# EAGLE design OptimuxPrimeSafe (EAGLE 8.3.2)
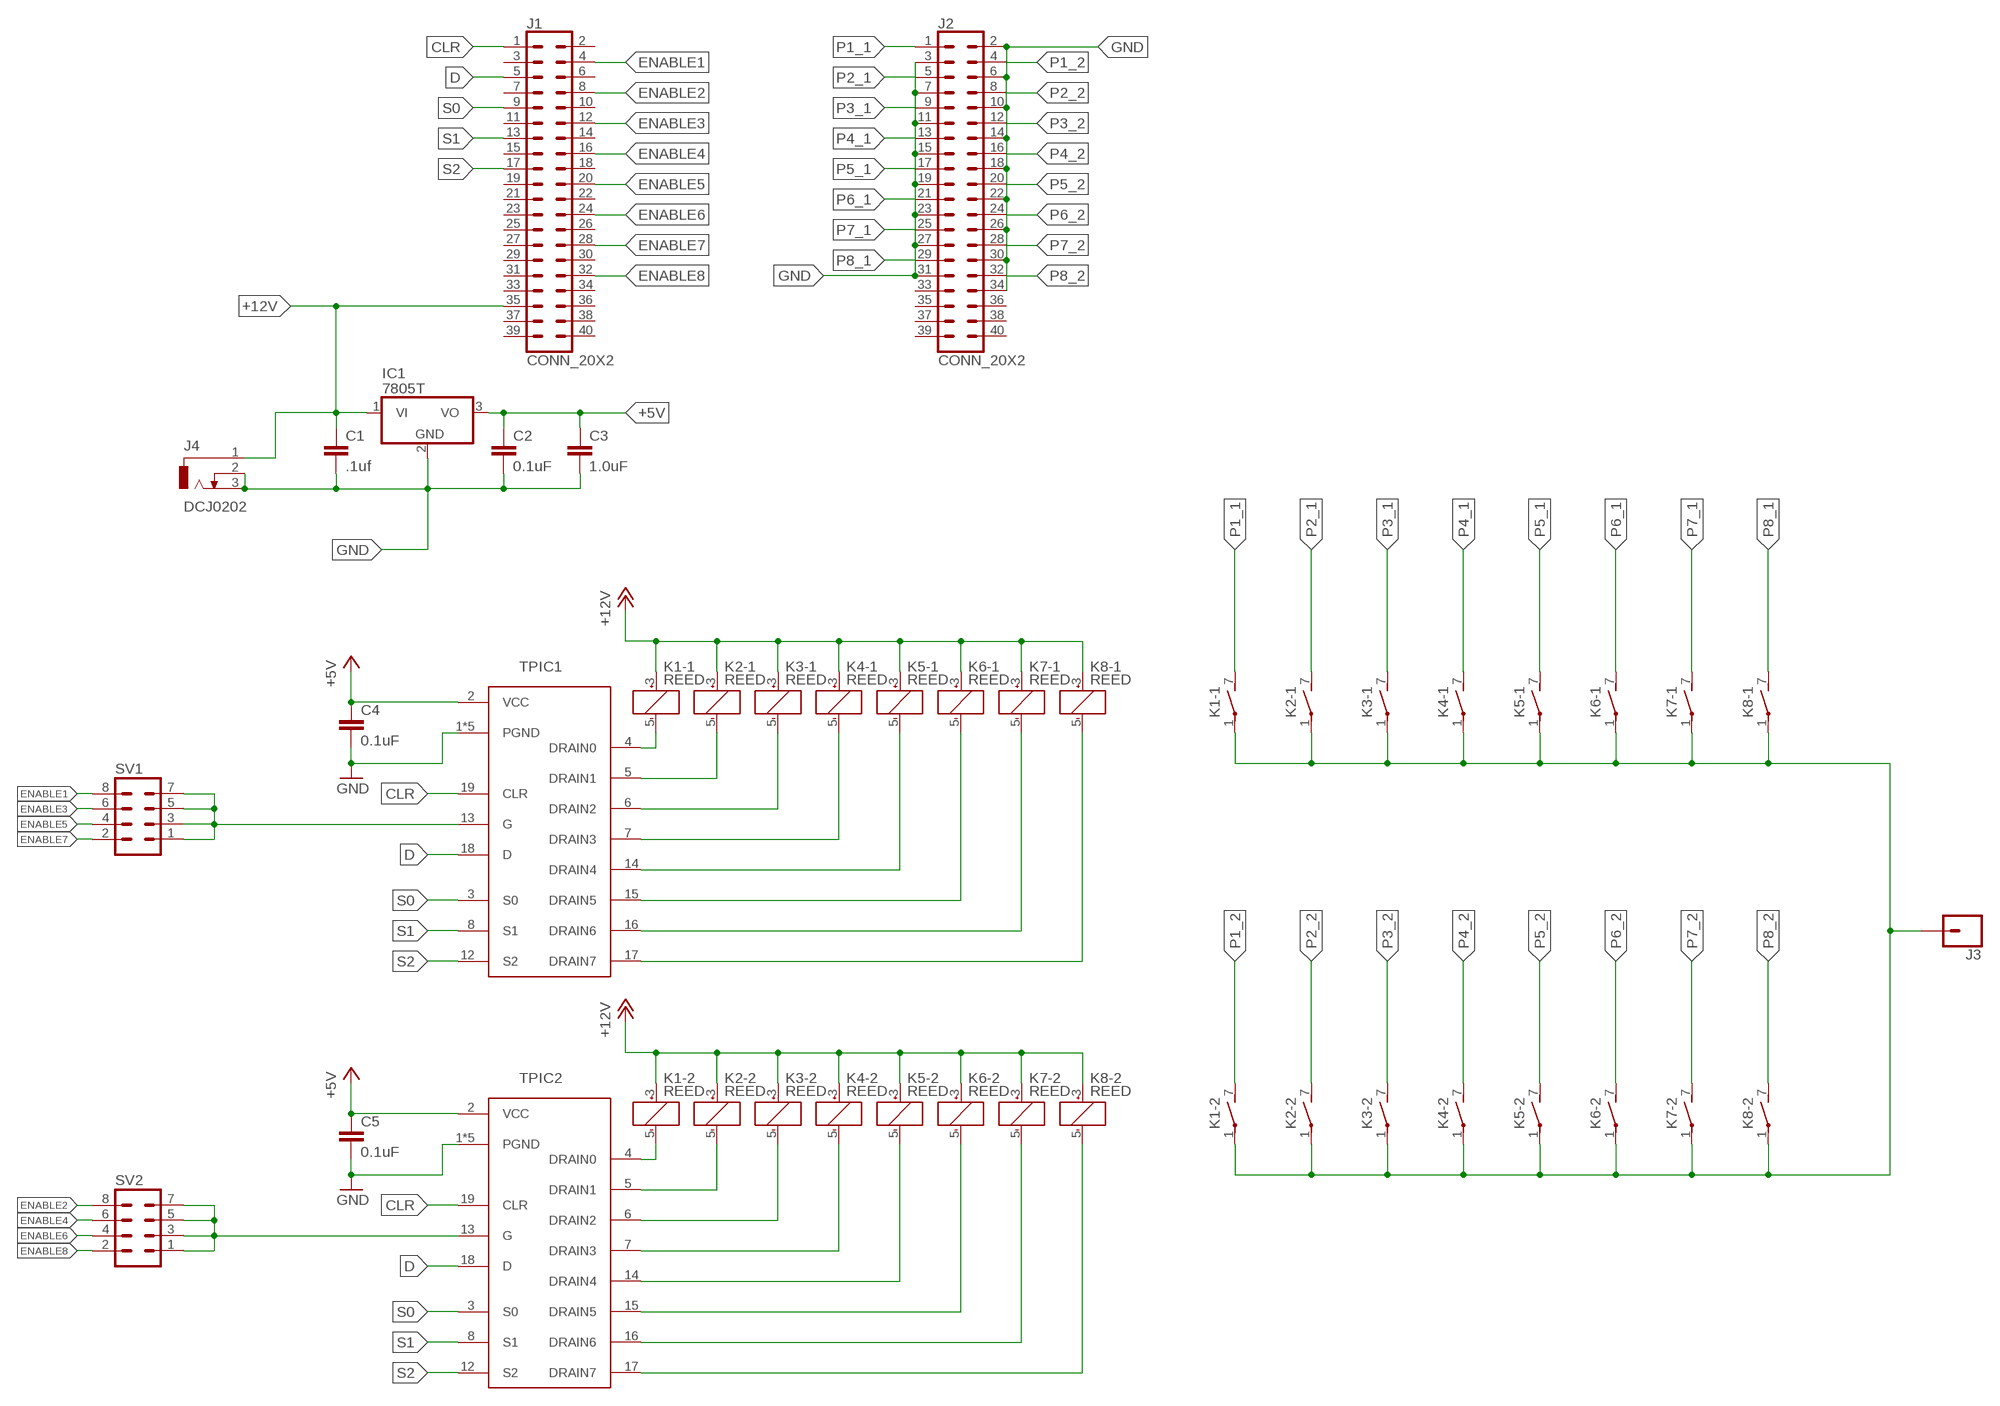
[diagram p0: schematic, sheet 1]

## Parts
C1  .1uf  1.0UF-0805-25V-(+80/-20%)  [0805]
C2  0.1uF  1.0UF-0805-25V-(+80/-20%)  [0805]
C3  1.0uF  1.0UF-0805-25V-(+80/-20%)  [0805]
C4  0.1uF  1.0UF-0805-25V-(+80/-20%)  [0805]
C5  0.1uF  1.0UF-0805-25V-(+80/-20%)  [0805]
IC1  7805T  [TO220H]
J1  CONN_20X2  [2X20]
J2  CONN_20X2  [2X20]
J3  CONN_01  [1X01]
J4  DCJ0202  [DCJ0202]
K1-1  REED  [REED]
K1-2  REED  [REED]
K2-1  REED  [REED]
K2-2  REED  [REED]
K3-1  REED  [REED]
K3-2  REED  [REED]
K4-1  REED  [REED]
K4-2  REED  [REED]
K5-1  REED  [REED]
K5-2  REED  [REED]
K6-1  REED  [REED]
K6-2  REED  [REED]
K7-1  REED  [REED]
K7-2  REED  [REED]
K8-1  REED  [REED]
K8-2  REED  [REED]
SV1  MA04-2  [MA04-2]
SV2  MA04-2  [MA04-2]
TPIC1  TPIC6259  [DIL20]
TPIC2  TPIC6259  [DIL20]

## Nets
+5V: C2.1 C3.1 C4.1 C5.1 IC1.3(VO) TPIC1.2(VCC) TPIC2.2(VCC)
+12V: C1.1 IC1.1(VI) J1.35 J4.1 K1-1.3(1:+) K1-2.3(1:+) K2-1.3(1:+) K2-2.3(1:+) K3-1.3(1:+) K3-2.3(1:+) K4-1.3(1:+) K4-2.3(1:+) K5-1.3(1:+) K5-2.3(1:+) K6-1.3(1:+) K6-2.3(1:+) K7-1.3(1:+) K7-2.3(1:+) K8-1.3(1:+) K8-2.3(1:+)
CLR: J1.1 TPIC1.19(CLR) TPIC2.19(CLR)
D: J1.5 TPIC1.18(D) TPIC2.18(D)
ENABLE1: J1.4 SV1.8
ENABLE2: J1.8 SV2.8
ENABLE3: J1.12 SV1.6
ENABLE4: J1.16 SV2.6
ENABLE5: J1.20 SV1.4
ENABLE6: J1.24 SV2.4
ENABLE7: J1.28 SV1.2
ENABLE8: J1.32 SV2.2
GND: C1.2 C2.2 C3.2 C4.2 C5.2 IC1.2(GND) J2.2 J2.3 J2.6 J2.7 J2.10 J2.11 J2.14 J2.15 J2.18 J2.19 J2.22 J2.23 J2.26 J2.27 J2.30 J2.31 J2.34 J4.2 J4.3 TPIC1.1(PGND) TPIC1.9(PGND) TPIC1.10(PGND) TPIC1.11(PGND) TPIC1.20(PGND) TPIC2.1(PGND) TPIC2.9(PGND) TPIC2.10(PGND) TPIC2.11(PGND) TPIC2.20(PGND)
N$1: K1-1.5(1:-) TPIC1.4(DRAIN0)
N$2: K2-1.5(1:-) TPIC1.5(DRAIN1)
N$3: K3-1.5(1:-) TPIC1.6(DRAIN2)
N$4: K4-1.5(1:-) TPIC1.7(DRAIN3)
N$5: K5-1.5(1:-) TPIC1.14(DRAIN4)
N$6: K6-1.5(1:-) TPIC1.15(DRAIN5)
N$7: K7-1.5(1:-) TPIC1.16(DRAIN6)
N$8: K8-1.5(1:-) TPIC1.17(DRAIN7)
N$9: SV1.1 SV1.3 SV1.5 SV1.7 TPIC1.13(G)
N$17: SV2.1 SV2.3 SV2.5 SV2.7 TPIC2.13(G)
N$18: K1-2.5(1:-) TPIC2.4(DRAIN0)
N$19: K2-2.5(1:-) TPIC2.5(DRAIN1)
N$20: K3-2.5(1:-) TPIC2.6(DRAIN2)
N$21: K4-2.5(1:-) TPIC2.7(DRAIN3)
N$22: K5-2.5(1:-) TPIC2.14(DRAIN4)
N$23: K6-2.5(1:-) TPIC2.15(DRAIN5)
N$24: K7-2.5(1:-) TPIC2.16(DRAIN6)
N$25: K8-2.5(1:-) TPIC2.17(DRAIN7)
P1_1: J2.1 K1-1.7(2:S)
P1_2: J2.4 K1-2.7(2:S)
P2_1: J2.5 K2-1.7(2:S)
P2_2: J2.8 K2-2.7(2:S)
P3_1: J2.9 K3-1.7(2:S)
P3_2: J2.12 K3-2.7(2:S)
P4_1: J2.13 K4-1.7(2:S)
P4_2: J2.16 K4-2.7(2:S)
P5_1: J2.17 K5-1.7(2:S)
P5_2: J2.20 K5-2.7(2:S)
P6_1: J2.21 K6-1.7(2:S)
P6_2: J2.24 K6-2.7(2:S)
P7_1: J2.25 K7-1.7(2:S)
P7_2: J2.28 K7-2.7(2:S)
P8_1: J2.29 K8-1.7(2:S)
P8_2: J2.32 K8-2.7(2:S)
S0: J1.9 TPIC1.3(S0) TPIC2.3(S0)
S1: J1.13 TPIC1.8(S1) TPIC2.8(S1)
S2: J1.17 TPIC1.12(S2) TPIC2.12(S2)
SCOPE_OUT: J3.1 K1-1.1(2:P) K1-2.1(2:P) K2-1.1(2:P) K2-2.1(2:P) K3-1.1(2:P) K3-2.1(2:P) K4-1.1(2:P) K4-2.1(2:P) K5-1.1(2:P) K5-2.1(2:P) K6-1.1(2:P) K6-2.1(2:P) K7-1.1(2:P) K7-2.1(2:P) K8-1.1(2:P) K8-2.1(2:P)
Unconnected: J1.2 J1.3 J1.6 J1.7 J1.10 J1.11 J1.14 J1.15 J1.18 J1.19 J1.21 J1.22 J1.23 J1.25 J1.26 J1.27 J1.29 J1.30 J1.31 J1.33 J1.34 J1.36 J1.37 J1.38 J1.39 J1.40 J2.33 J2.35 J2.36 J2.37 J2.38 J2.39 J2.40

## Library data of the parts
C1 C2 C4 C5 = SparkFun-Capacitors:1.0UF: 1µF ceramic capacitors A capacitor is a passive two-terminal electrical component used to store electrical energy temporarily in an electric field.; PROD_ID: CAP-11625; VALUE: 1.0uF
C3 = SparkFun-Capacitors:1.0UF: 1µF ceramic capacitors A capacitor is a passive two-terminal electrical component used to store electrical energy temporarily in an electric field.; PROD_ID: CAP-11625
IC1 = linear:78*: Positive VOLTAGE REGULATOR Source: http://cache.national.com/ds/LM/LM78L05.pdf http://www.fairchildsemi.com/ds/LM/LM7805.pdf
J1 J2 = SparkFun-Connectors:CONN_20X2: Multi connection point. Often used as Generic Header-pin footprint for 0.1 inch spaced/style header connections On any of the 0.1 inch spaced packages, you can populate with these: Break Away Headers - Straight <https://www.sparkfun.com/products/116> (PRT-00116) Break Away Male Headers - Right Angle <https://www.sparkfun.com/products/553> (PRT-00553) Female Headers <https://www.sparkfun.com/products/115> (PRT-00115) Break Away Headers - Machine Pin <https://www.sparkfun.com/products/117> (PRT-00117) Break Away Female Headers - Swiss Machine Pin <https://www.sparkfun.com/products/743> (PRT-00743)
J3 = SparkFun-Connectors:CONN_01: Single connection point. Often used as Generic Header-pin footprint for 0.1 inch spaced/style header connections On any of the 0.1 inch spaced packages, you can populate with these: Break Away Headers - Straight <https://www.sparkfun.com/products/116> (PRT-00116) Break Away Male Headers - Right Angle <https://www.sparkfun.com/products/553> (PRT-00553) Female Headers <https://www.sparkfun.com/products/115> (PRT-00115) Break Away Headers - Machine Pin <https://www.sparkfun.com/products/117> (PRT-00117) Break Away Female Headers - Swiss Machine Pin <https://www.sparkfun.com/products/743> (PRT-00743) This device is also useful as a general connection point to wire up your design to another part of your project. Our various solder wires solder well into these plated through hole pads. Hook-Up Wire - Assortment (Stranded, 22 AWG) <https://www.sparkfun.com/products/11375> (PRT-11375) Hook-Up Wire - Assortment (Solid Core, 22 AWG) <https://www.sparkfun.com/products/11367> (PRT-11367) View the entire wire category on our website here <https://www.sparkfun.com/categories/141> Special notes: SMTSO-256-ET is a "flush mount" nut for a 4-40 screw. We mostly use this on specialty testbeds; it is a nice way to connect hardware to your PCB at an adjustable hieght. Also note, the SNAP packages are for using a snappable style connector. We sell a baggie of snaps and they are also used on two LilyPad designs: Snap Assortment - 30 pack (male and female) <https://www.sparkfun.com/products/11347> (DEV-11347) LilyPad Arduino SimpleSnap <https://www.sparkfun.com/products/10941> (DEV-10941) LilyPad SimpleSnap Protoboard <https://www.sparkfun.com/products/10940> (DEV-10940)
J4 = con-jack:DCJ0202: DC POWER JACK Source: DCJ0202.pdf; OC_FARNELL: unknown; OC_NEWARK: unknown
K1-1 K1-2 K2-1 K2-2 K3-1 K3-2 K4-1 K4-2 K5-1 K5-2 K6-1 K6-2 K7-1 K7-2 K8-1 K8-2 = relay:REED: RELAY reed, 1 x norm. open with polarity, grid 5.08; OC_FARNELL: unknown; OC_NEWARK: unknown
SV1 SV2 = con-lstb:MA04-2: PIN HEADER; OC_FARNELL: unknown; OC_NEWARK: unknown
TPIC1 TPIC2 = TPIC6259:TPIC6259: Power Logic 8-bit Addressable Latch

## Net classes
0 default: width 0.508 mm

## Board
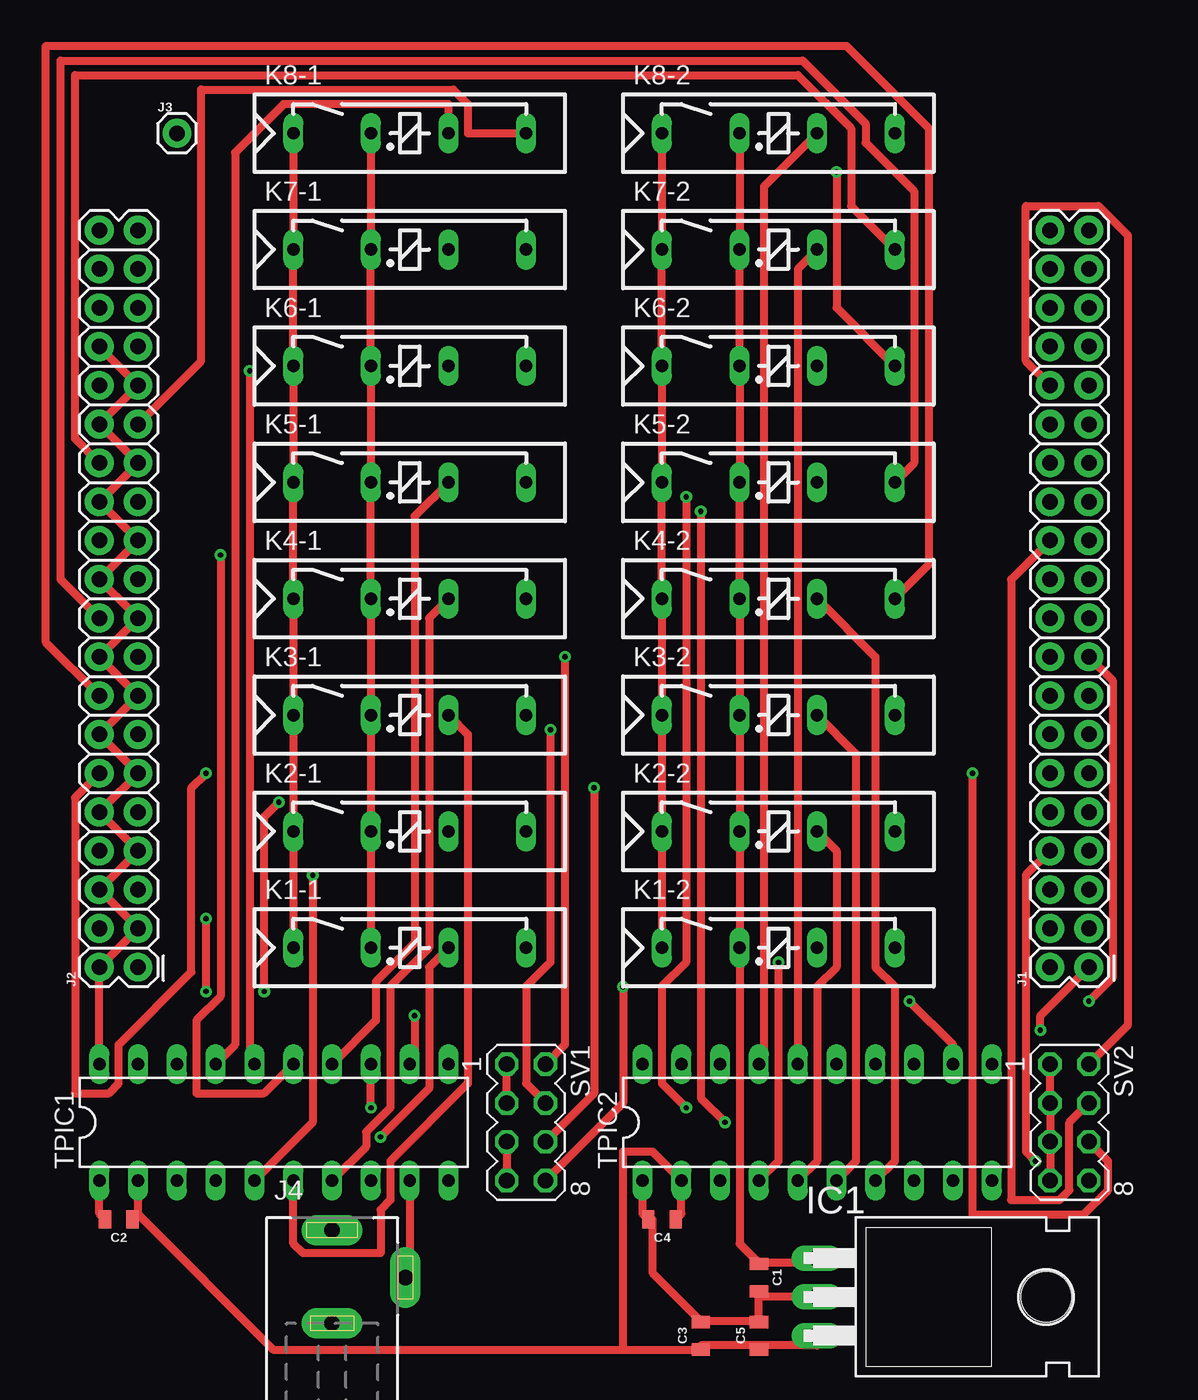
[diagram p1: board, top side]
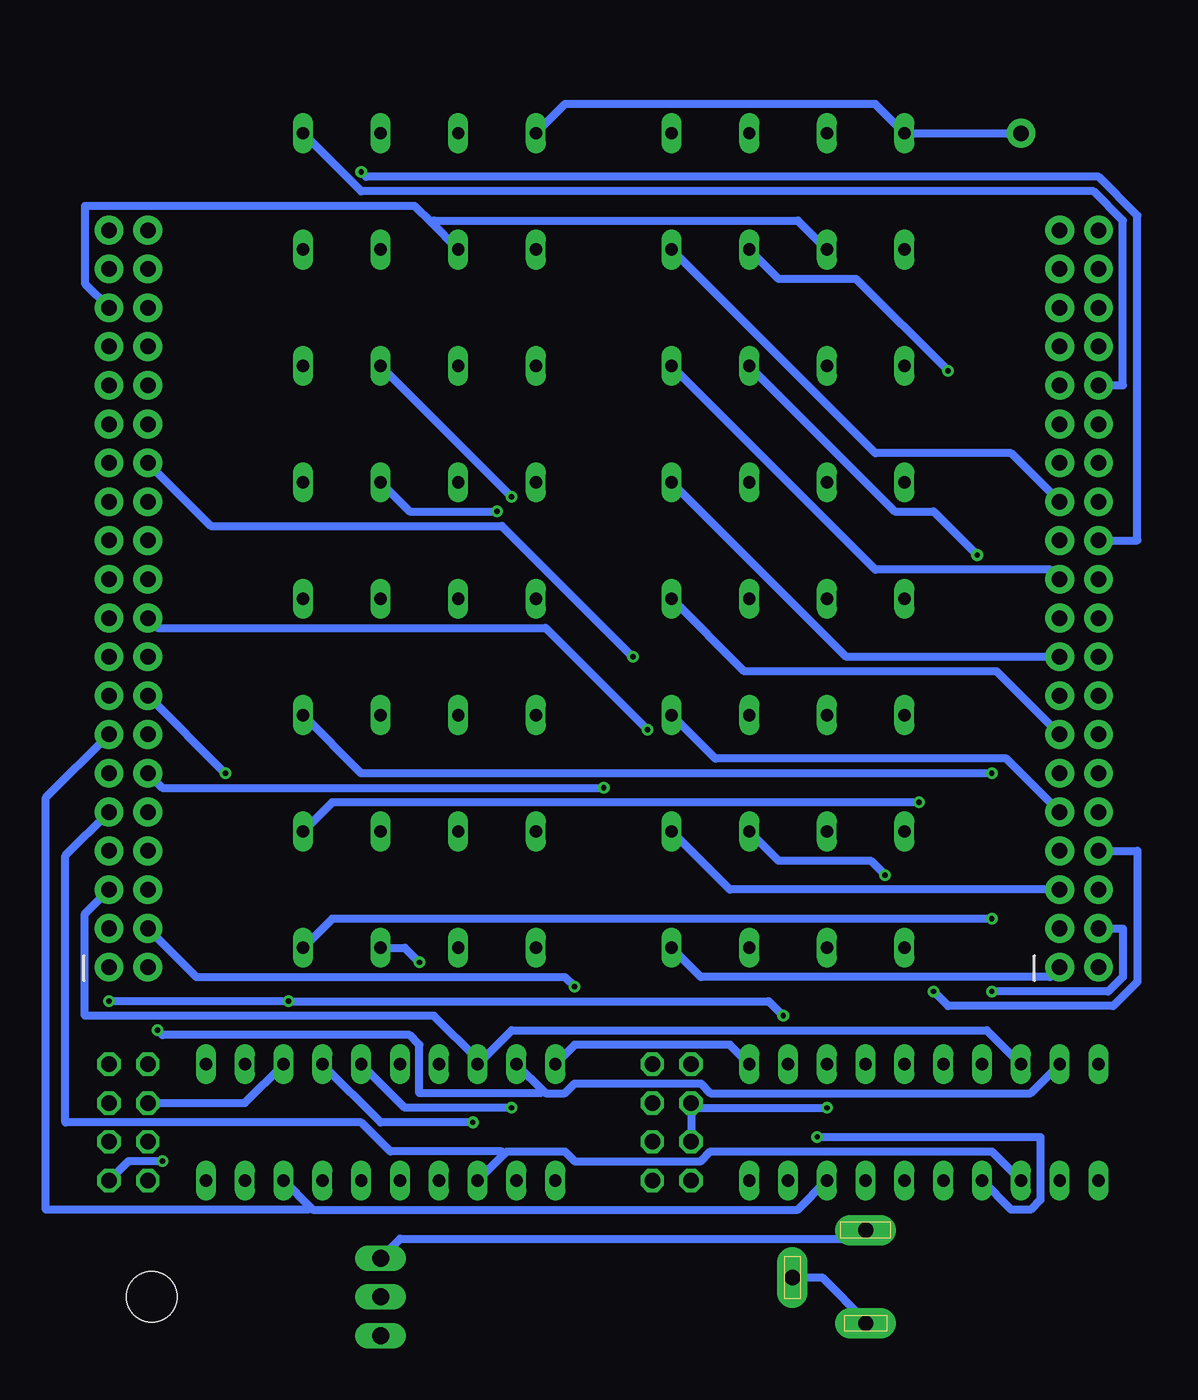
[diagram p2: board, bottom side, seen from below]

No outline drawn. Coordinates in mm, seen from the top.
Copper layers (1*16): Top 0.035mm / dielectric 1.5mm / Bottom 0.035mm
Design rules "default *": minimum track width 6mil, minimum drill 0.35mm, track to track 10mil, track to pad 10mil, pad to pad 6mil, via to via 6mil, smd to smd 6mil, copper to edge 40mil, drill to drill 6mil, minimum pad ring 10mil, minimum via ring 8mil, stop-mask expansion 4mil, vias tented up to drill 0mil, thermal gap 10mil

### Footprints (pad centres in the part's own frame; a part is rotated, then mirrored left to right if it is on the bottom)
0805 = smd 0.8 x 1.2: 1 -0.9,0; 2 0.9,0
TO220H = drill 1.118 long: 1 -2.54,-10.16; 2 0,-10.16; 3 2.54,-10.16 | hole 3.302: 0,4.826
2X20 = drill 1.016 pad 1.88: 1 0,0; 2 0,2.54; 3 2.54,0; 4 2.54,2.54; 5 5.08,0; 6 5.08,2.54; 7 7.62,0; 8 7.62,2.54; 9 10.16,0; 10 10.16,2.54; 11 12.7,0; 12 12.7,2.54; 13 15.24,0; 14 15.24,2.54; 15 17.78,0; 16 17.78,2.54; 17 20.32,0; 18 20.32,2.54; 19 22.86,0; 20 22.86,2.54; 21 25.4,0; 22 25.4,2.54; 23 27.94,0; 24 27.94,2.54; 25 30.48,0; 26 30.48,2.54; 27 33.02,0; 28 33.02,2.54; 29 35.56,0; 30 35.56,2.54; 31 38.1,0; 32 38.1,2.54; 33 40.64,0; 34 40.64,2.54; 35 43.18,0; 36 43.18,2.54; 37 45.72,0; 38 45.72,2.54; 39 48.26,0; 40 48.26,2.54
1X01 = drill 1.016 pad 1.88: 1 0,0
DCJ0202 = drill 1 pad 2 long: 1 0,3.1; 2 4.8,0; 3 0,-3
REED = drill 0.813 long: 1 -17.78,2.54; 3 -12.7,2.54; 5 -7.62,2.54; 7 -2.54,2.54
MA04-2 = drill 1.016 octagon: 1 -3.81,-1.27; 2 -3.81,1.27; 3 -1.27,-1.27; 4 -1.27,1.27; 5 1.27,-1.27; 6 1.27,1.27; 7 3.81,-1.27; 8 3.81,1.27
DIL20 = drill 0.813 long: 1 -11.43,-3.81; 2 -8.89,-3.81; 3 -6.35,-3.81; 4 -3.81,-3.81; 5 -1.27,-3.81; 6 1.27,-3.81; 7 3.81,-3.81; 8 6.35,-3.81; 9 8.89,-3.81; 10 11.43,-3.81; 11 11.43,3.81; 12 8.89,3.81; 13 6.35,3.81; 14 3.81,3.81; 15 1.27,3.81; 16 -1.27,3.81; 17 -3.81,3.81; 18 -6.35,3.81; 19 -8.89,3.81; 20 -11.43,3.81

### Placement (x,y rotation side)
C1  53.34,3.81 270 top
C2  11.43,7.62 180 top
C3  49.53,0 90 top
C4  46.99,7.62 180 top
C5  53.34,0 90 top
IC1  67.31,2.54 270 top
J1  74.93,24.13 90 top
J2  12.7,24.13 90 top
J3  15.24,78.74 0 top
J4  25.4,3.81 0 top
K1-1  40.64,22.86 0 top
K1-2  64.77,22.86 0 top
K2-1  40.64,30.48 0 top
K2-2  64.77,30.48 0 top
K3-1  40.64,38.1 0 top
K3-2  64.77,38.1 0 top
K4-1  40.64,45.72 0 top
K4-2  64.77,45.72 0 top
K5-1  40.64,53.34 0 top
K5-2  64.77,53.34 0 top
K6-1  40.64,60.96 0 top
K6-2  64.77,60.96 0 top
K7-1  40.64,68.58 0 top
K7-2  64.77,68.58 0 top
K8-1  40.64,76.2 0 top
K8-2  64.77,76.2 0 top
SV1  38.1,13.97 270 top
SV2  73.66,13.97 270 top
TPIC1  21.59,13.97 0 top
TPIC2  57.15,13.97 0 top

### Tracks (layer width: path | path; a pad name or v marks a point on that pad's centre or on a via)
+5V
  Top 0.508: C4.1 48.26,7.99 TPIC2.2 46.35,12.06 44.45,12.06 44.45,-0.95 | TPIC1.2 12.7,7.99 C2.1 12.7,7.94 21.59,-0.95 44.45,-0.95 | 53.34,-0.64 49.53,-0.64 C3.1 49.53,-0.95 44.45,-0.95 | 53.34,-0.64 57.15,-0.64 IC1.3 | 53.34,-0.64 C5.1
+12V
  Top 0.508: K8-1.3 K7-1.3 K6-1.3 K5-1.3 K4-1.3 K3-1.3 K2-1.3 K1-1.3 | 53.34,4.76 57.15,4.76 IC1.1 | K8-2.3 K7-2.3 K6-2.3 K5-2.3 K4-2.3 K3-2.3 K2-2.3 K1-2.3 52.07,6.03 53.34,4.76 | 53.34,4.76 C1.1
  Bottom 0.508: IC1.1 55.88,6.35 25.72,6.35 25.4,6.67 J4.1 | J1.35 76.52,68.9 76.52,73.98 54.93,73.98 53.82,72.87 | K7-2.3 53.82,72.87 | K7-1.3 29.84,73.03 53.66,73.03 53.82,72.87
CLR  (via drill 0.35)
  Top 0.508: J1.1 71.75,20.95 v71.75,20
  Bottom 0.508: TPIC1.19 14.61,15.88 35.56,15.88 36.2,16.51 44.45,16.51 45.09,15.88 46.35,15.88 46.51,16.03 | TPIC2.19 46.51,16.03 | v71.75,20 71.44,19.68 55.24,19.68 54.61,19.05 54.61,15.88 46.67,15.88 46.51,16.03
D
  Bottom 0.508: TPIC1.18 17.46,20 48.58,20 TPIC2.18 50.8,18.1 53.66,20.95 76.52,20.95 76.52,27.62 J1.5
ENABLE1  (via drill 0.35)
  Top 0.508: SV1.8 44.45,15.24 v44.45,22.86
  Bottom 0.508: v44.45,22.86 45.09,23.5 69.22,23.5 J1.4
ENABLE2  (via drill 0.35)
  Top 0.508: v71.44,11.43 70.8,12.06 70.8,30.16 J1.8
  Bottom 0.508: SV2.8 73.66,11.43 v71.44,11.43
ENABLE3  (via drill 0.35)
  Top 0.508: SV1.6 42.55,15.88 v42.55,35.88
  Bottom 0.508: v42.55,35.88 71.44,35.88 J1.12
ENABLE4  (via drill 0.35)
  Top 0.508: SV2.6 76.2,11.43 76.2,9.53 74.61,7.94 67.31,7.94 v67.31,36.83
  Bottom 0.508: J1.16 v67.31,36.83
ENABLE5  (via drill 0.35)
  Top 0.508: SV1.4 38.1,16.51 38.1,22.86 39.69,24.45 v39.69,39.69
  Bottom 0.508: v39.69,39.69 46.35,46.35 71.75,46.35 J1.20
ENABLE6
  Top 0.508: SV2.4 73.66,13.97 73.66,9.53 73.03,8.89 69.85,8.89 69.85,49.53 J1.24
ENABLE7  (via drill 0.35)
  Top 0.508: SV1.2 40.64,19.05 v40.64,44.45
  Bottom 0.508: v40.64,44.45 49.21,53.02 68.26,53.02 J1.28
ENABLE8
  Top 0.508: SV2.2 77.47,20.32 77.47,72.07 75.56,73.98 70.8,73.98 70.8,63.82 J1.32
GND
  Top 0.508: TPIC2.1 45.72,7.99 C4.2 46.35,7.62 46.35,4.13 49.53,0.95 | C2.2 10.16,7.99 TPIC1.1 | J2.34 12.38,62.55 12.38,62.23 J2.31 10.48,60.01 10.48,59.69 J2.30 12.38,57.47 12.38,57.15 J2.27 10.48,54.93 10.48,54.61 J2.26 12.38,52.39 12.38,52.07 J2.23 10.48,49.85 10.48,49.53 J2.22 12.38,47.31 12.38,46.99 J2.19 10.48,44.77 10.48,44.45 J2.18 12.38,42.23 12.38,41.91 J2.15 10.48,39.69 10.48,39.37 J2.14 12.38,37.15 12.38,36.83 J2.11 10.48,34.61 10.48,34.29 J2.10 12.38,32.07 12.38,31.75 J2.7 10.48,29.53 10.48,29.21 J2.6 12.38,26.99 12.38,26.67 J2.3 J2.2 TPIC1.20 | 53.34,0.95 49.53,0.95 | 53.34,0.95 53.34,2.54 | 53.34,2.54 C1.2 53.34,2.86 | 53.34,0.95 C5.2 | IC1.2 53.34,2.54 | 49.53,0.95 C3.2 | TPIC1.9 30.48,3.81 J4.2
  Bottom 0.508: J4.2 28.26,3.81 25.4,0.95 J4.3 | TPIC2.20 44.45,19.05 34.29,19.05 TPIC1.11
N$1  (via drill 0.35)
  Top 0.508: v28.57,13.02 31.75,16.19 31.75,24.13 K1-1.5
  Bottom 0.508: TPIC1.4 15.88,8.26 14.61,8.26 13.97,8.89 13.97,13.02 v28.57,13.02
N$2  (via drill 0.35)
  Top 0.508: TPIC1.5 24.13,13.97 v24.13,30.16
  Bottom 0.508: v24.13,30.16 25.08,31.11 31.11,31.11 K2-1.5
N$3
  Top 0.508: TPIC1.6 22.86,6.03 23.5,5.4 28.57,5.4 28.57,8.26 29.21,8.89 29.21,11.43 34.29,16.51 34.29,39.37 K3-1.5
N$4
  Top 0.508: TPIC1.7 27.62,12.38 27.62,13.34 29.21,14.92 29.21,22.86 31.75,25.4 31.75,46.99 K4-1.5
N$5
  Top 0.508: TPIC1.14 28.26,20.64 28.26,23.18 30.8,25.72 30.8,53.66 K5-1.5
N$6  (via drill 0.35)
  Top 0.508: TPIC1.15 20.95,15.88 16.51,15.88 16.51,20.64 18.1,22.23 v18.1,51.12
  Bottom 0.508: v18.1,51.12 20.95,53.98 23.5,53.98 K6-1.5
N$7  (via drill 0.35)
  Top 0.508: TPIC1.16 20,18.1 v20,63.18
  Bottom 0.508: v20,63.18 26.04,69.22 31.11,69.22 K7-1.5
N$8
  Top 0.508: TPIC1.17 19.05,19.05 19.05,77.47 22.23,80.64 33.02,80.64 K8-1.5
N$9  (via drill 0.35)
  Top 0.508: SV1.5 SV1.7 | v27.94,14.92 TPIC1.13 | SV1.3 SV1.1
  Bottom 0.508: v27.94,14.92 36.51,14.92 SV1.3 SV1.5
N$17
  Top 0.508: SV2.7 SV2.5 SV2.3 SV2.1
  Bottom 0.508: TPIC2.13 66.04,15.24 SV2.3
N$18  (via drill 0.35)
  Top 0.508: TPIC2.4 54.61,11.43 v54.61,24.45
  Bottom 0.508: v54.61,24.45 55.56,25.4 K1-2.5
N$19
  Top 0.508: TPIC2.5 57.15,11.43 57.15,22.86 58.42,24.13 58.42,31.75 K2-2.5
N$20
  Top 0.508: TPIC2.6 59.69,11.43 59.69,38.1 K3-2.5
N$21
  Top 0.508: TPIC2.7 62.23,11.43 62.23,22.86 60.96,24.13 60.96,44.45 K4-2.5
N$22  (via drill 0.35)
  Top 0.508: v51.12,13.97 49.53,15.56 v49.53,53.98
  Bottom 0.508: TPIC2.14 57.15,13.97 v51.12,13.97 | v49.53,53.98 55.24,53.98 K5-2.5
N$23  (via drill 0.35)
  Top 0.508: v48.58,14.92 46.99,16.51 46.99,22.86 48.58,24.45 v48.58,54.93
  Bottom 0.508: TPIC2.15 55.56,14.92 v48.58,14.92 | K6-2.5 v48.58,54.93
N$24
  Top 0.508: TPIC2.16 55.88,69.85 K7-2.5
N$25
  Top 0.508: TPIC2.17 53.66,18.1 53.66,75.25 K8-2.5
P1_1
  Bottom 0.508: K1-1.7 36.2,23.5 13.34,23.5 J2.1
P1_2  (via drill 0.35)
  Top 0.508: v17.14,22.54 v17.14,27.3
  Bottom 0.508: K1-2.7 60.33,27.3 v17.14,27.3 | v17.14,22.54 9.53,22.54 8.57,23.5 8.57,26.67 J2.4
P2_1
  Bottom 0.508: K2-1.7 34.29,29.21 J2.5
P2_2  (via drill 0.35)
  Top 0.508: v21.91,34.92 20.95,33.97 v20.95,22.54
  Bottom 0.508: K2-2.7 60.33,34.92 v21.91,34.92 | v20.95,22.54 20,21.59 9.21,21.59 7.62,23.18 7.62,31.75 J2.8
P3_1
  Bottom 0.508: K3-1.7 35.24,37.78 16.19,37.78 J2.9
P3_2  (via drill 0.35)
  Top 0.508: v17.14,36.83 16.19,35.88 16.19,23.81 11.43,19.05 11.43,16.51 10.79,15.88 8.57,15.88 8.57,35.24 J2.12
  Bottom 0.508: K3-2.7 58.42,36.83 v17.14,36.83
P4_1
  Bottom 0.508: K4-1.7 33.34,43.5 16.83,43.5 J2.13
P4_2
  Top 0.508: K4-2.7 64.45,50.48 64.45,79.06 59.05,84.45 6.67,84.45 6.67,45.4 J2.16
P5_1
  Bottom 0.508: K5-1.7 26.67,44.45 J2.17
P5_2
  Top 0.508: K5-2.7 63.5,57.15 63.5,74.93 60.33,78.11 60.33,79.38 56.2,83.5 7.62,83.5 7.62,49.53 J2.20
P6_1
  Bottom 0.508: K6-1.7 24.77,50.16 13.34,50.16 J2.21
P6_2  (via drill 0.35)
  Top 0.508: K6-2.7 58.42,67.31 v58.42,76.2
  Bottom 0.508: v58.42,76.2 58.1,75.88 10.16,75.88 7.62,73.34 7.62,52.07 J2.24
P7_1
  Bottom 0.508: K7-1.7 24.77,57.78 15.88,57.78 J2.25
P7_2
  Top 0.508: K7-2.7 59.37,73.98 59.37,79.06 55.88,82.55 8.57,82.55 8.57,58.74 J2.28
P8_1
  Top 0.508: K8-1.7 34.29,78.74 34.29,80.64 33.34,81.6 16.83,81.6 16.83,63.82 J2.29
P8_2
  Bottom 0.508: K8-2.7 58.42,74.93 10.48,74.93 8.57,73.03 8.57,62.23 J2.32
S0
  Bottom 0.508: TPIC1.3 17.14,12.06 35.56,12.06 36.2,11.43 44.45,11.43 45.09,12.06 48.9,12.06 49.05,11.91 | TPIC2.3 49.05,11.91 | J1.9 77.79,31.43 77.79,13.97 58.42,13.97 56.52,12.06 49.21,12.06 49.05,11.91
S1
  Bottom 0.508: TPIC1.8 29.84,8.26 61.59,8.26 61.75,8.41 | TPIC2.8 61.75,8.41 | J1.13 79.06,35.24 79.06,8.26 61.91,8.26 61.75,8.41
S2  (via drill 0.35)
  Top 0.508: TPIC1.12 30.8,18.1 v30.8,20.95 | v63.18,21.91 66.04,19.05 TPIC2.12 | J1.17 76.52,42.86 76.52,23.5 v74.93,21.91
  Bottom 0.508: v30.8,20.95 31.75,21.91 v63.18,21.91 v74.93,21.91
SCOPE_OUT
  Top 0.508: K8-2.1 K7-2.1 K6-2.1 K5-2.1 K4-2.1 K3-2.1 K2-2.1 K1-2.1 | K8-1.1 K7-1.1 K6-1.1 K5-1.1 K4-1.1 K3-1.1 K2-1.1 K1-1.1
  Bottom 0.508: J3.1 K8-1.1 24.77,80.64 45.09,80.64 K8-2.1